# Altium schematic sheet CATS-EUROC-Pyro_Enable.SchDoc: CATS EuRoC Edition
size A4; DocumentNumber: Overview; Revision: V1.0; SheetNumber: 9; SheetTotal: 16; Author: Luca Jost; Subtitle: Pyro Power Enable
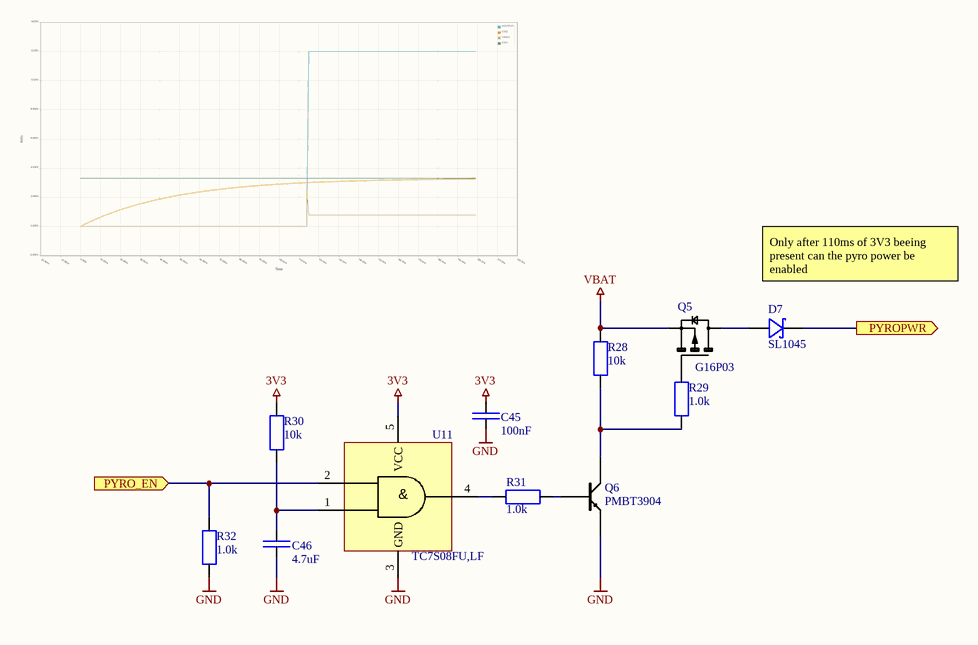
[diagram p0: CATS-EUROC-Pyro_Enable.SchDoc]

## Parts
C45  100nF  [SMD Keramikkondensator 0402]
C46  4.7uF  [SMD Keramikkondensator 0402]
D7  SL1045  [SMD Diode TO-277]
Q5  G16P03  [SMD MOSFET DFN 3x3 EP]
Q6  PMBT3904  [SMD Transistor SOT-23]
R28  10k  [SMD Widerstand 0402]
R29  1.0k  [SMD Widerstand 0402]
R30  10k  [SMD Widerstand 0402]
R31  1.0k  [SMD Widerstand 0402]
R32  1.0k  [SMD Widerstand 0402]
U11  TC7S08FU,LF  [SMD IC SSOP5-P-0.65A (SOT353-1)]

## Ports
PYRO_EN (in), PYROPWR (out)

## Nets
3V3: C45.2 R30.2 U11.5(VCC)
GND: C45.1 C46.1 Q6.E R32.1 U11.3(GND)
VBAT: Q5.S R28.2
PYRO_EN: R32.2 U11.2(IN) ; port PYRO_EN
PYROPWR: D7.K ; port PYROPWR
NetC46_2: C46.2 R30.1 U11.1(IN)
NetD7_A: D7.A Q5.D
NetQ5_G: Q5.G R29.2
NetQ6_B: Q6.B R31.1
NetQ6_C: Q6.C R28.1 R29.1
NetR31_2: R31.2 U11.4(OUT)

## Notes on the sheet
- Only after 110ms of 3V3 beeing present can the pyro power be enabled
- Title
- Author:
- Subtitle
- Date:
- Rev:
- File:
- Sheet
- of
- (in symbol TC7S08FU,LF) &

## Library data of the parts
C45 = E6 - 100nF: SMD Ceramic Capacitor E6; Unit Price: 0.01; Number: -; Supplier: -; JLC: C307331
C46 = E6 - 4.7uF: SMD Ceramic Capacitor E6; Unit Price: 0.01; Number: -; Supplier: -; JLC: C23733
D7 = SL1045: 45V 470mV@10A 10A TO-277 Schottky Barrier Diodes; ComponentLink1Description: Datasheet; ComponentLink1URL: https://datasheet.lcsc.com/lcsc/1810252210_MDD-Microdiode-Electronics--SL1045_C65021.pdf; JLC: C113945
Q5 = G16P03: 30V 16A 35W; ComponentLink1Description: Datasheet; ComponentLink1URL: https://datasheet.lcsc.com/lcsc/1809251724_GOFORD-G16P03_C193982.pdf; JLC: C471913
Q6 = PMBT3904: 40 V, 200 mA NPN switching transisto; ComponentLink1Description: Datasheet; ComponentLink1URL: https://datasheet.lcsc.com/lcsc/2105201004_Nexperia-PMBT3904-215_C8667.pdf; JLC: C8667
R28 R30 = E24 - 10k: SMD Chip Resistor E24; Unit Price: 0.01; Number: -; Supplier: -; JLC: C25744
R29 R31 R32 = E24 - 1.0k: SMD Chip Resistor E24; Unit Price: 0.01; Number: -; Supplier: -; JLC: C11702
U11 = TC7S08FU,LF: AND Gate SSOP5-P-0.65A; ComponentLink1Description: Datasheet; ComponentLink1URL: https://datasheet.lcsc.com/lcsc/1811082031_TOSHIBA-TC7S08FU-LF_C146362.pdf; JLC: C146362